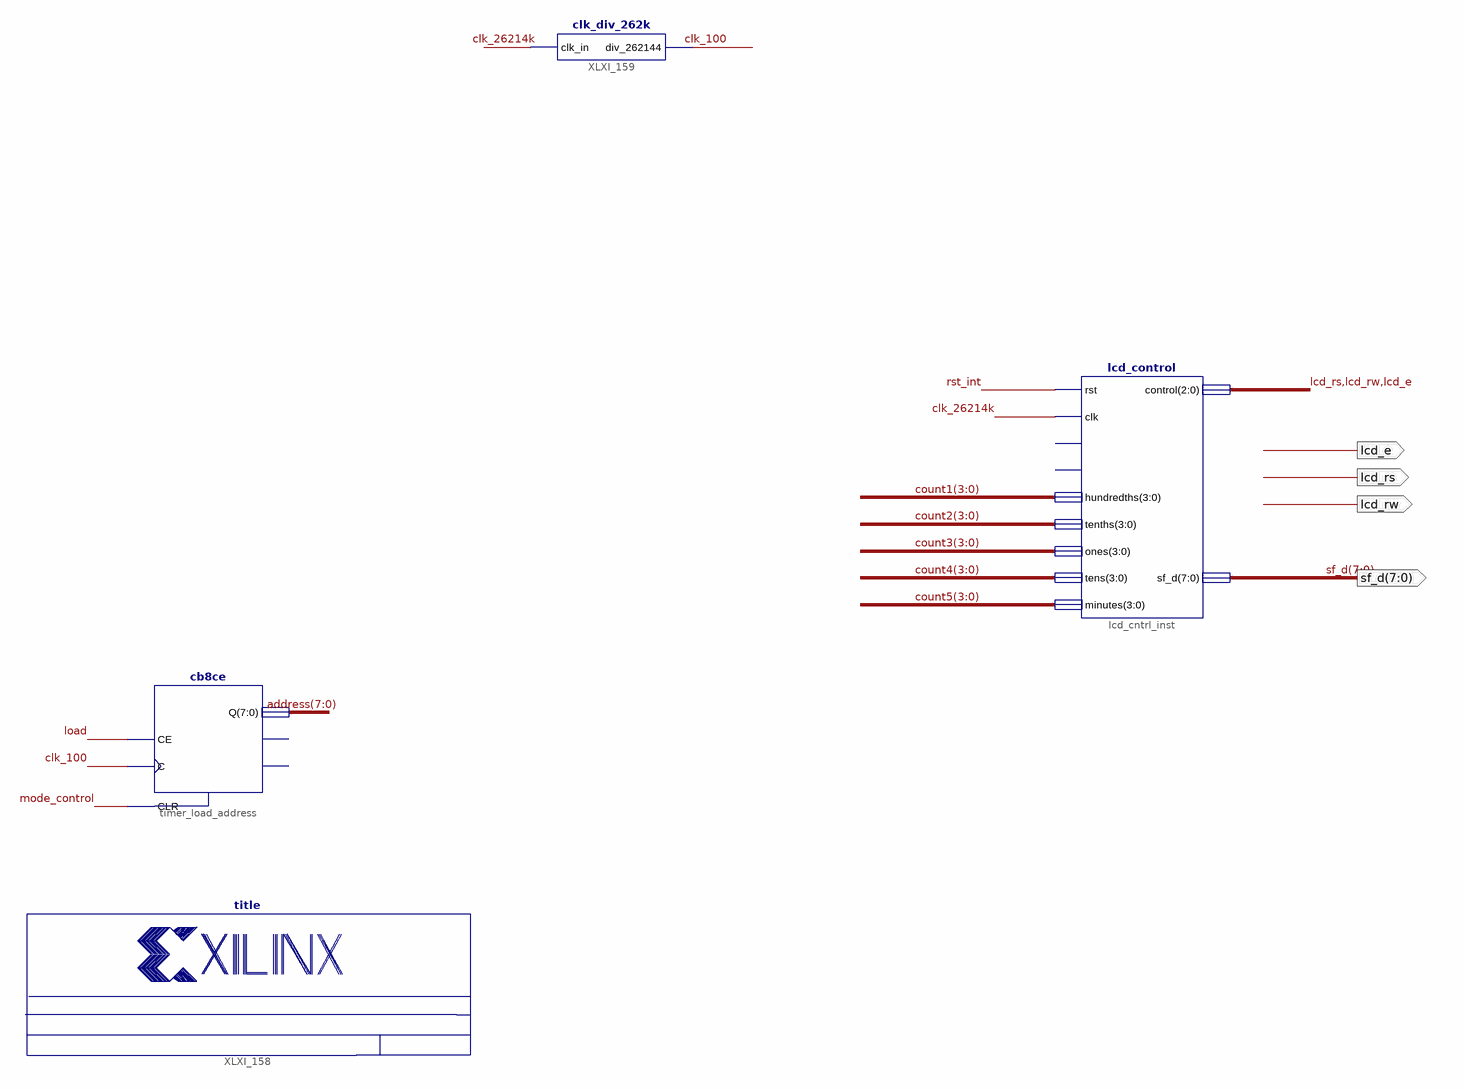
[diagram p0: schematic sheet 1]
// Xilinx ISE schematic stopwatch.sch (spartan3a) as structural Verilog: 4 symbols, 4 ports
module stopwatch (
  output [7:0] sf_d,
  output lcd_rw,
  output lcd_rs,
  output lcd_e
);

  wire clk_100, clk_26214k, load, mode_control, rst_int;
  wire [3:0] count1, count2, count3, count4, count5;
  wire [7:0] address;

  title #(.TitleFieldText("Stop Watch Tutorial"), .NameFieldText("Mr.Tutorial")) XLXI_158 ();
  lcd_control lcd_cntrl_inst (
    .rst(rst_int), .clk(clk_26214k), .control({lcd_rs, lcd_rw, lcd_e}), .sf_d(sf_d), .hundredths(count1),
    .tenths(count2), .ones(count3), .tens(count4), .minutes(count5));  // open: lap, mode
  cb8ce timer_load_address (.C(clk_100), .CE(load), .CLR(mode_control), .Q(address));  // open: CEO, TC
  clk_div_262k XLXI_159 (.clk_in(clk_26214k), .div_262144(clk_100));

  // Notes on the sheet:
  //   LOC on signal sf_d(7:0) = Y15,AB16,Y12,AA12,AB12,AB17,AB18,Y13
  //   LOC on signal lcd_rw = W13
  //   LOC on signal lcd_rs = Y14
  //   LOC on signal lcd_e = AB4
endmodule
